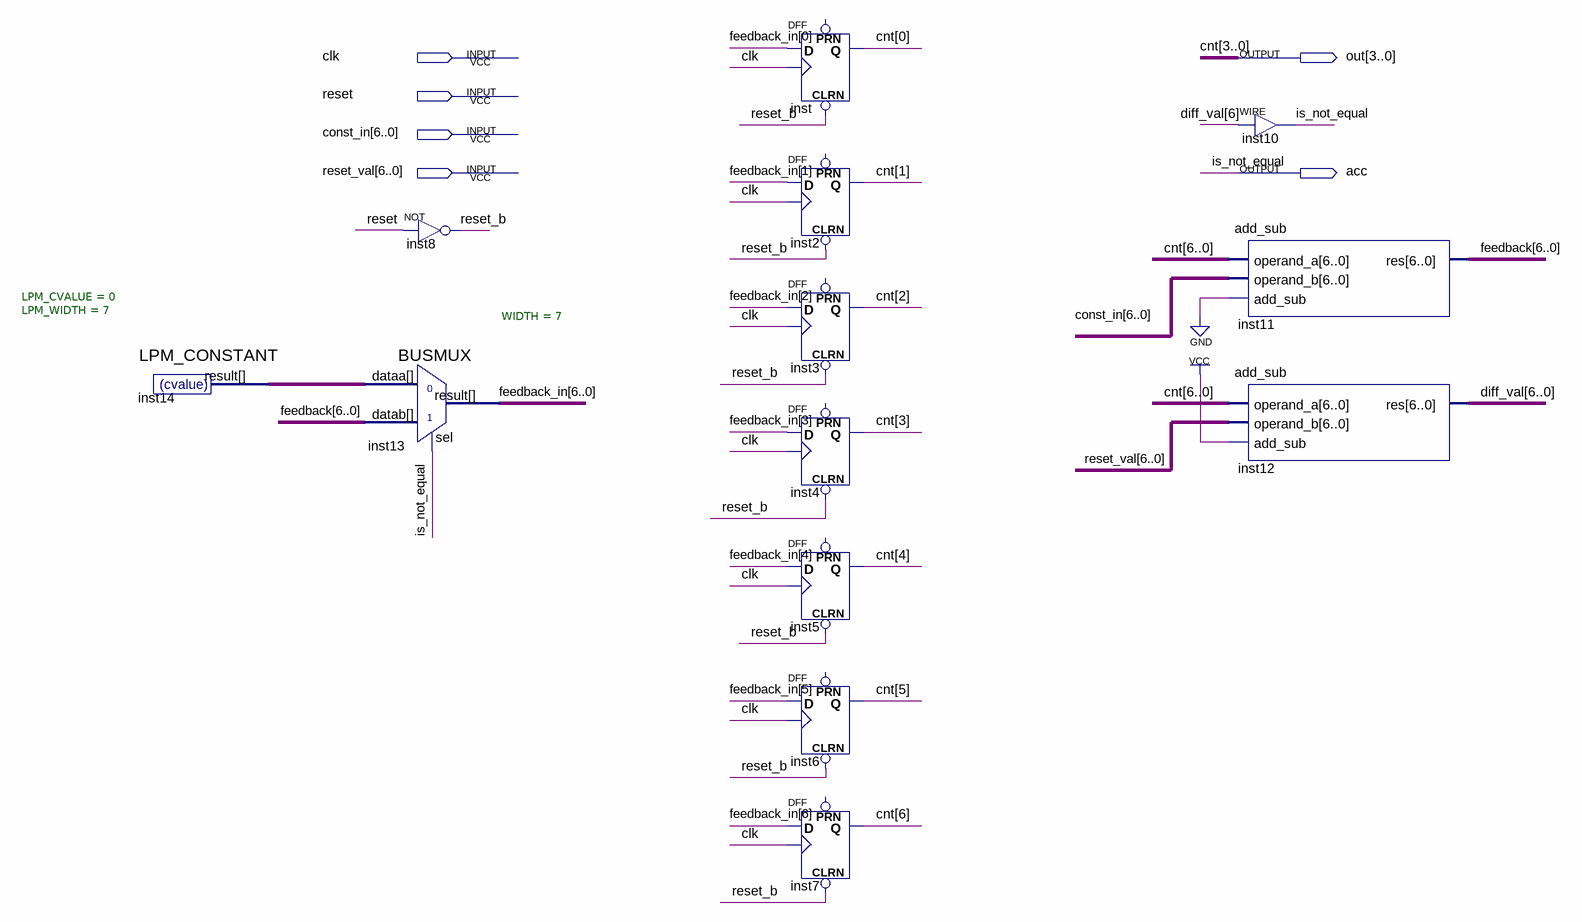
[diagram p0: schematic sheet]
// Quartus schematic counter.bdf as structural Verilog: 13 symbols, 6 pins
module counter (
  input  clk,
  input  reset,
  input  [6:0] const_in,
  input  [6:0] reset_val,
  output [3:0] out,
  output acc
);

  wire reset_b;
  wire [6:0] diff_val, feedback, feedback_in, inst14_result;
  wire [6:4] cnt;

  LPM_CONSTANT #(.LPM_CVALUE(0), .LPM_WIDTH(7)) inst14 (.result(inst14_result));
  not inst8 (reset_b, reset);
  BUSMUX #(.WIDTH(7)) inst13 (.datab(feedback), .sel(acc), .dataa(inst14_result), .result(feedback_in));
  DFF inst (.CLRN(reset_b), .CLK(clk), .D(feedback_in[0]), .Q(out[0]));  // open: PRN
  DFF inst2 (.CLRN(reset_b), .CLK(clk), .D(feedback_in[1]), .Q(out[1]));  // open: PRN
  DFF inst3 (.CLRN(reset_b), .CLK(clk), .D(feedback_in[2]), .Q(out[2]));  // open: PRN
  DFF inst4 (.CLRN(reset_b), .CLK(clk), .D(feedback_in[3]), .Q(out[3]));  // open: PRN
  DFF inst5 (.CLRN(reset_b), .CLK(clk), .D(feedback_in[4]), .Q(cnt[4]));  // open: PRN
  DFF inst6 (.CLRN(reset_b), .CLK(clk), .D(feedback_in[5]), .Q(cnt[5]));  // open: PRN
  DFF inst7 (.CLRN(reset_b), .CLK(clk), .D(feedback_in[6]), .Q(cnt[6]));  // open: PRN
  assign acc = diff_val[6];  // WIRE inst10
  add_sub inst11 (.operand_a({cnt, out}), .operand_b(const_in), .add_sub(1'b0), .res(feedback));
  add_sub inst12 (.operand_a({cnt, out}), .operand_b(reset_val), .add_sub(1'b1), .res(diff_val));

  // Other names for the same wires on the sheet: cnt[3:0] = out; is_not_equal = acc
endmodule
